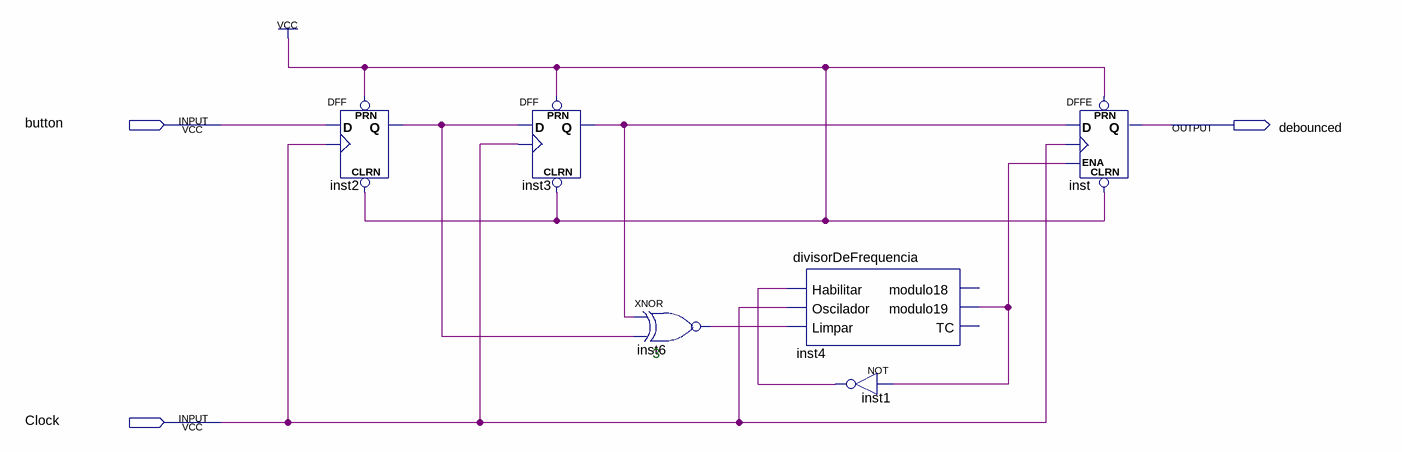
[diagram p0: schematic sheet]
// Quartus schematic debouncer.bdf as structural Verilog: 6 symbols, 3 pins
module debouncer (
  input  button,
  input  Clock,
  output debounced
);

  wire inst1_out, inst2_q, inst3_q, inst4_modulo19, inst6_out;

  DFF inst2 (.CLRN(1'b1), .CLK(Clock), .D(button), .PRN(1'b1), .Q(inst2_q));
  DFF inst3 (.CLRN(1'b1), .CLK(Clock), .D(inst2_q), .PRN(1'b1), .Q(inst3_q));
  xnor inst6 (inst6_out, inst3_q, inst2_q);
  divisorDeFrequencia inst4 (
    .Habilitar(inst1_out), .Oscilador(Clock), .Limpar(inst6_out), .modulo19(inst4_modulo19));  // open: modulo18, TC
  not inst1 (inst1_out, inst4_modulo19);
  DFFE inst (.PRN(1'b1), .CLRN(1'b1), .D(inst3_q), .CLK(Clock), .ENA(inst4_modulo19), .Q(debounced));

  // Notes on the sheet:
  //   3
endmodule
